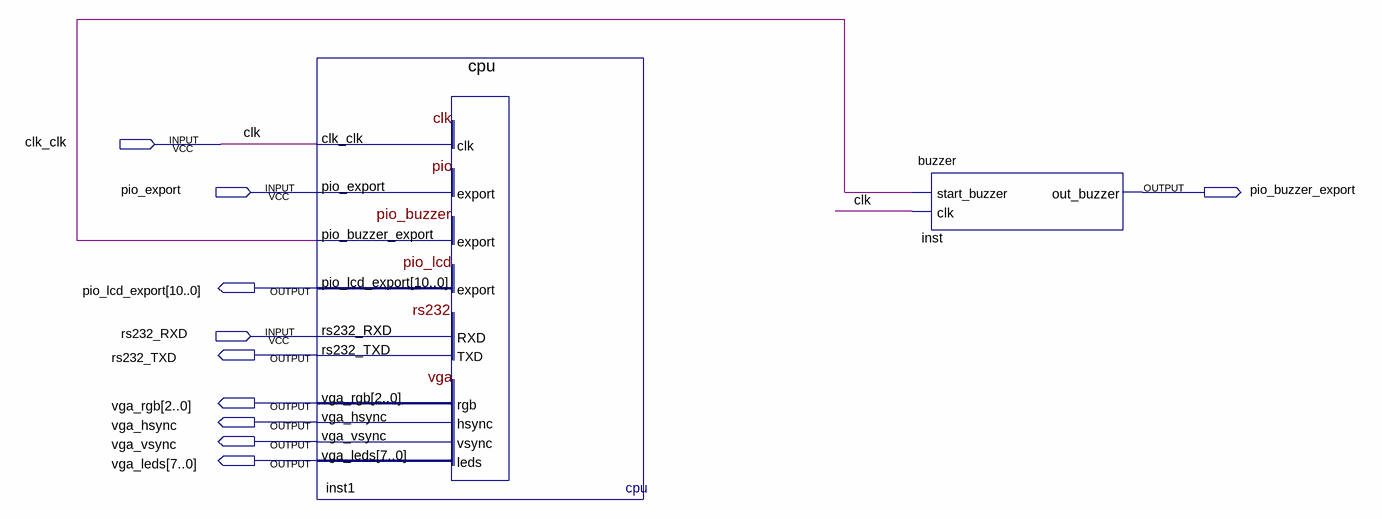
[diagram p0: schematic sheet]
// Quartus schematic chinchila.bdf as structural Verilog: 2 symbols, 10 pins
module chinchila (
  input  clk_clk,
  input  pio_export,
  input  rs232_RXD,
  output pio_buzzer_export,
  output [10:0] pio_lcd_export,
  output rs232_TXD,
  output [2:0] vga_rgb,
  output vga_hsync,
  output vga_vsync,
  output [7:0] vga_leds
);

  wire inst1_pio_buzzer_export;

  cpu inst1 (
    .clk_clk(clk_clk), .pio_export(pio_export), .rs232_RXD(rs232_RXD),
    .pio_buzzer_export(inst1_pio_buzzer_export), .pio_lcd_export(pio_lcd_export), .rs232_TXD(rs232_TXD),
    .vga_rgb(vga_rgb), .vga_hsync(vga_hsync), .vga_vsync(vga_vsync), .vga_leds(vga_leds));
  buzzer inst (.start_buzzer(inst1_pio_buzzer_export), .clk(clk_clk), .out_buzzer(pio_buzzer_export));

  // Other names for the same wires on the sheet: clk = clk_clk
endmodule
